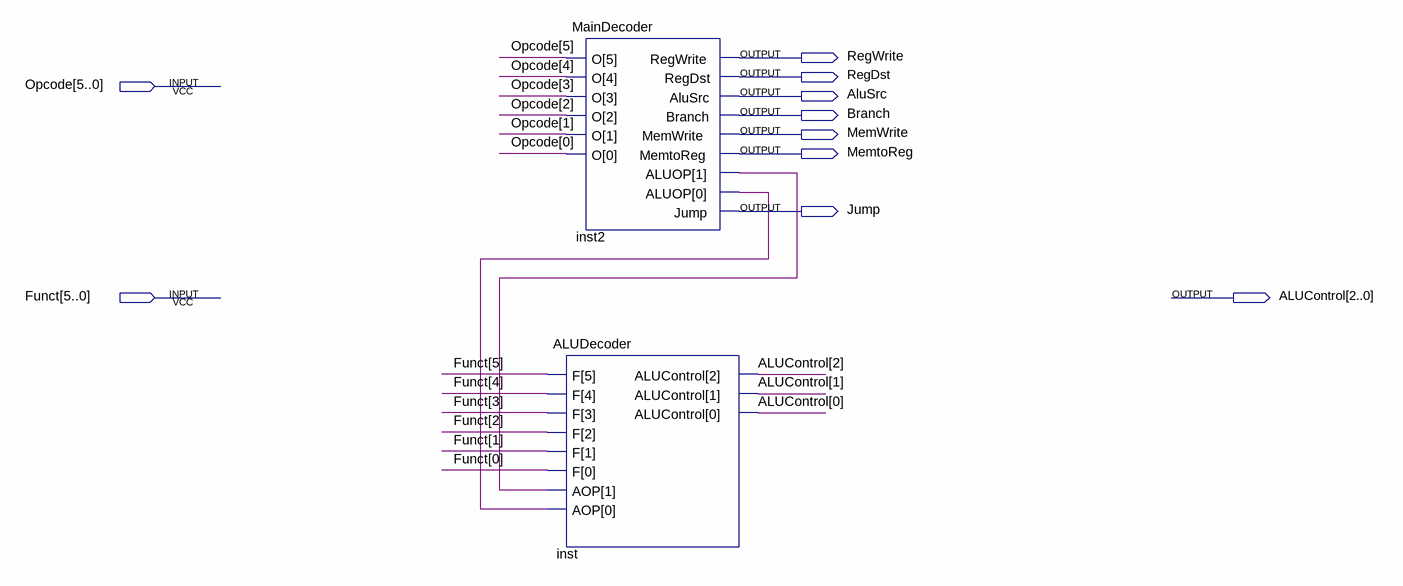
[diagram p0: schematic sheet]
// Quartus schematic Control_Unit.bdf as structural Verilog: 2 symbols, 10 pins
module Control_Unit (
  input  [5:0] Opcode,
  input  [5:0] Funct,
  output RegWrite,
  output RegDst,
  output AluSrc,
  output Branch,
  output MemWrite,
  output MemtoReg,
  output Jump,
  output [2:0] ALUControl
);

  wire inst2_aluop, inst2_aluop_2;

  ALUDecoder inst (.F(Funct), .AOP({inst2_aluop, inst2_aluop_2}), .ALUControl(ALUControl));
  MainDecoder inst2 (
    .O(Opcode), .RegWrite(RegWrite), .RegDst(RegDst), .AluSrc(AluSrc), .Branch(Branch), .MemWrite(MemWrite),
    .MemtoReg(MemtoReg), .ALUOP({inst2_aluop, inst2_aluop_2}), .Jump(Jump));
endmodule
